# EAGLE design data_acqsation_system (EAGLE 9.6.2)
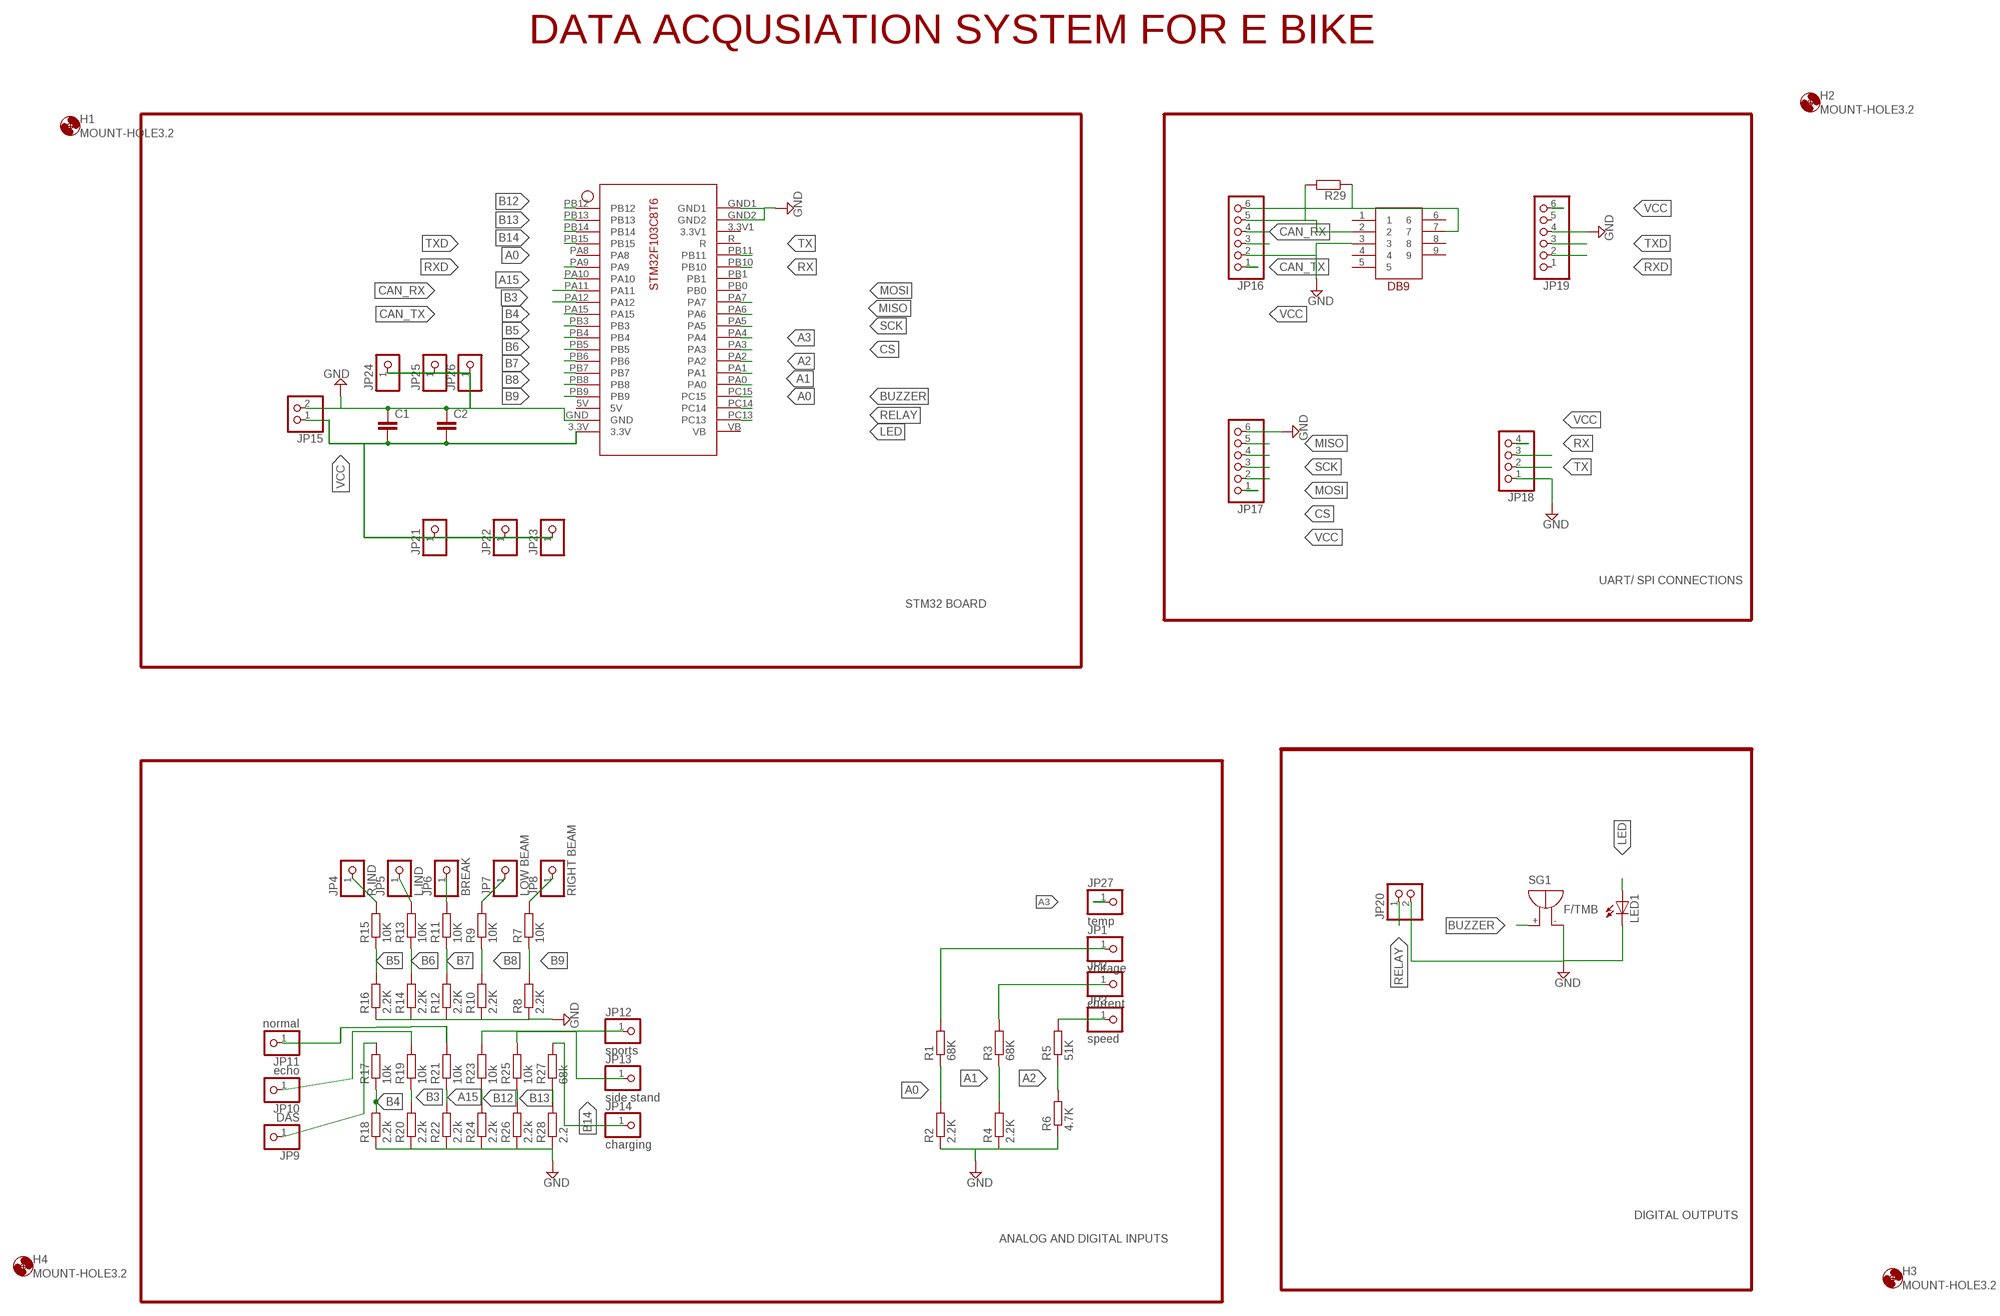
[diagram p0: schematic, sheet 1]

## Parts
C1  C2.5/6  [C2.5-6]
C2  C2.5/6  [C2.5-6]
H1  MOUNT-HOLE3.2  [3,2]
H2  MOUNT-HOLE3.2  [3,2]
H3  MOUNT-HOLE3.2  [3,2]
H4  MOUNT-HOLE3.2  [3,2]
JP1  voltage  PINHD-1X1  [1X01]
JP2  current  PINHD-1X1  [1X01]
JP3  speed  PINHD-1X1  [1X01]
JP4  R.IND  PINHD-1X1  [1X01]
JP5  L.IND  PINHD-1X1  [1X01]
JP6  BREAK  PINHD-1X1  [1X01]
JP7  LOW BEAM  PINHD-1X1  [1X01]
JP8  RIGHT BEAM  PINHD-1X1  [1X01]
JP9  DAS  PINHD-1X1  [1X01]
JP10  echo  PINHD-1X1  [1X01]
JP11  normal  PINHD-1X1  [1X01]
JP12  sports  PINHD-1X1  [1X01]
JP13  side stand  PINHD-1X1  [1X01]
JP14  charging  PINHD-1X1  [1X01]
JP15  PINHD-1X2  [1X02]
JP16  PINHD-1X6  [1X06]
JP17  PINHD-1X6  [1X06]
JP18  PINHD-1X4  [1X04]
JP19  PINHD-1X6  [1X06]
JP20  PINHD-1X2  [1X02]
JP21  PINHD-1X1  [1X01]
JP22  PINHD-1X1  [1X01]
JP23  PINHD-1X1  [1X01]
JP24  PINHD-1X1  [1X01]
JP25  PINHD-1X1  [1X01]
JP26  PINHD-1X1  [1X01]
JP27  temp  PINHD-1X1  [1X01]
LED1  LED5MM  [LED5MM]
R1  68K  R-EU_0309/12  [0309/12]
R2  2.2K  R-EU_0309/12  [0309/12]
R3  68K  R-EU_0309/12  [0309/12]
R4  2.2K  R-EU_0309/12  [0309/12]
R5  51K  R-EU_0309/12  [0309/12]
R6  4.7K  R-EU_0309/12  [0309/12]
R7  10K  R-EU_0309/12  [0309/12]
R8  2.2K  R-EU_0309/12  [0309/12]
R9  10K  R-EU_0309/12  [0309/12]
R10  2.2K  R-EU_0309/12  [0309/12]
R11  10K  R-EU_0309/12  [0309/12]
R12  2.2K  R-EU_0309/12  [0309/12]
R13  10K  R-EU_0309/12  [0309/12]
R14  2.2K  R-EU_0309/12  [0309/12]
R15  10K  R-EU_0309/12  [0309/12]
R16  2.2K  R-EU_0309/12  [0309/12]
R17  10k  R-EU_0309/12  [0309/12]
R18  2.2k  R-EU_0309/12  [0309/12]
R19  10k  R-EU_0309/12  [0309/12]
R20  2.2k  R-EU_0309/12  [0309/12]
R21  10k  R-EU_0309/12  [0309/12]
R22  2.2k  R-EU_0309/12  [0309/12]
R23  10k  R-EU_0309/12  [0309/12]
R24  2.2k  R-EU_0309/12  [0309/12]
R25  10k  R-EU_0309/12  [0309/12]
R26  2.2k  R-EU_0309/12  [0309/12]
R27  68k  R-EU_0309/12  [0309/12]
R28  2.2  R-EU_0309/12  [0309/12]
R29  R-EU_0309/12  [0309/12]
SG1  F/TMB  [F/TMB]
U$1  STM32F103C8T6  [STM32F103C8T6]
U$2  DB9  [DB9]

## Nets
A0: R1.1 R2.2 U$1.PA0 U$1.PB15
A1: R3.1 R4.2 U$1.PA1
A2: R5.1 R6.2 U$1.PA2
A3: JP27.1 U$1.PA4
A15: R21.1 R22.2 U$1.PA15
B3: R19.1 R20.2 U$1.PB3
B4: R17.1 R18.2 U$1.PB4
B5: R15.1 R16.2 U$1.PB5
B6: R13.1 R14.2 U$1.PB6
B7: R11.1 R12.2 U$1.PB7
B8: R9.1 R10.2 U$1.PB8
B9: R7.1 R8.2 U$1.PB9
B12: R23.1 R24.2 U$1.PB12
B13: R25.1 R26.2 U$1.PB13
B14: R27.1 R28.2 U$1.PB14
BUZZER: SG1.+ U$1.PC15
CAN_RX: JP16.4 U$1.PA11
CAN_TX: JP16.3 U$1.PA12
CS: JP17.2 U$1.PA3
GND: C1.1 C2.1 JP15.2 JP16.2 JP17.6 JP18.1 JP19.4 JP20.2 JP24.1 JP25.1 JP26.1 LED1.K(C) R2.1 R4.1 R6.1 R8.1 R10.1 R12.1 R14.1 R16.1 R18.1 R20.1 R22.1 R24.1 R26.1 R28.1 SG1.- U$1.GND U$1.GND1 U$1.GND2 U$2.3
LED: LED1.A U$1.PC13
MISO: JP17.5 U$1.PA6
MOSI: JP17.3 U$1.PA7
N$1: JP3.1 R5.2
N$2: JP2.1 R3.2
N$3: JP1.1 R1.2
N$4: JP11.1 R21.2
N$18: JP8.1 R7.2
N$19: JP7.1 R9.2
N$20: JP6.1 R11.2
N$21: JP5.1 R13.2
N$22: JP4.1 R15.2
N$23: JP9.1 R17.2
N$24: JP16.5 R29.2 U$2.2
N$25: JP10.1 R19.2
N$27: JP14.1 R27.2
N$28: JP13.1 R25.2
N$29: JP12.1 R23.2
N$30: JP16.6 R29.1 U$2.7
RELAY: JP20.1 U$1.PC14
RX: JP18.3 U$1.PB10
RXD: JP19.2 U$1.PA10
SCK: JP17.4 U$1.PA5
TX: JP18.2 U$1.PB11
TXD: JP19.3 U$1.PA9
VCC: C1.2 C2.2 JP15.1 JP16.1 JP17.1 JP18.4 JP19.6 JP21.1 JP22.1 JP23.1 U$1.3.3V
Unconnected: JP19.1 JP19.5 U$1.3.3V1 U$1.5V U$1.PA8 U$1.PB0 U$1.PB1 U$1.R U$1.VB U$2.1 U$2.4 U$2.5 U$2.6 U$2.8 U$2.9

## Notes on the sheet
- DATA ACQUSIATION SYSTEM FOR E BIKE
- UART/ SPI CONNECTIONS
- STM32 BOARD
- DIGITAL OUTPUTS
- ANALOG AND DIGITAL INPUTS

## Library data of the parts
C1 C2 = capacitor-wima:C: CAPACITOR naming: grid - package width
H1-H4 = holes:MOUNT-HOLE: MOUNTING HOLE with drill center marker
JP1-JP14 JP21-JP27 = pinhead:PINHD-1X1: PIN HEADER
JP15 JP20 = pinhead:PINHD-1X2: PIN HEADER
JP16 JP17 JP19 = pinhead:PINHD-1X6: PIN HEADER
JP18 = pinhead:PINHD-1X4: PIN HEADER
LED1 = led:LED: LED OSRAM: - CHIPLED LG R971, LG N971, LY N971, LG Q971, LY Q971, LO R971, LY R971 LH N974, LH R974 LS Q976, LO Q976, LY Q976 LO Q996 - Hyper CHIPLED LW Q18S LB Q993, LB Q99A, LB R99A - SideLED LS A670, LO A670, LY A670, LG A670, LP A670 LB A673, LV A673, LT A673, LW A673 LH A674 LY A675 LS A676, LA A676, LO A676, LY A676, LW A676 LS A679, LY A679, LG A679 - Hyper Micro SIDELED® LS Y876, LA Y876, LO Y876, LY Y876 LT Y87S - SmartLED LW L88C, LW L88S LB L89C, LB L89S, LG L890 LS L89K, LO L89K, LY L89K LS L896, LA L896, LO L896, LY L896 - TOPLED LS T670, LO T670, LY T670, LG T670, LP T670 LSG T670, LSP T670, LSY T670, LOP T670, LYG T670 LG T671, LOG T671, LSG T671 LB T673, LV T673, LT T673, LW T673 LH T674 LS T676, LA T676, LO T676, LY T676, LB T676, LH T676, LSB T676, LW T676 LB T67C, LV T67C, LT T67C, LS T67K, LO T67K, LY T67K, LW E67C LS E67B, LA E67B, LO E67B, LY E67B, LB E67C, LV E67C, LT E67C LW T67C LS T679, LY T679, LG T679 LS T770, LO T770, LY T770, LG T770, LP T770 LB T773, LV T773, LT T773, LW T773 LH T774 LS E675, LA E675, LY E675, LS T675 LS T776, LA T776, LO T776, LY T776, LB T776 LHGB T686 LT T68C, LB T68C - Hyper Mini TOPLED® LB M676 - Mini TOPLED Santana® LG M470 LS M47K, LO M47K, LY M47K Source: http://www.osram.convergy.de LUXEON: - LUMILED® LXK2-PW12-R00, LXK2-PW12-S00, LXK2-PW14-U00, LXK2-PW14-V00 LXK2-PM12-R00, LXK2-PM12-S00, LXK2-PM14-U00 LXK2-PE12-Q00, LXK2-PE12-R00, LXK2-PE12-S00, LXK2-PE14-T00, LXK2-PE14-U00 LXK2-PB12-K00, LXK2-PB12-L00, LXK2-PB12-M00, LXK2-PB14-N00, LXK2-PB14-P00, LXK2-PB14-Q00 LXK2-PR12-L00, LXK2-PR12-M00, LXK2-PR14-Q00, LXK2-PR14-R00 LXK2-PD12-Q00, LXK2-PD12-R00, LXK2-PD12-S00 LXK2-PH12-R00, LXK2-PH12-S00 LXK2-PL12-P00, LXK2-PL12-Q00, LXK2-PL12-R00 Source: www.luxeon.com KINGBRIGHT: KA-3528ASYC Source: www.kingbright.com
R1-R29 = rcl:R-EU_: RESISTOR, European symbol
SG1 = buzzer:F/TMB: BUZZER Source: Buerklin; OC_FARNELL: unknown; OC_NEWARK: unknown
U$1 = STM32F103C81:STM32F103C8T6
U$2 = DB9:DB9

## Board
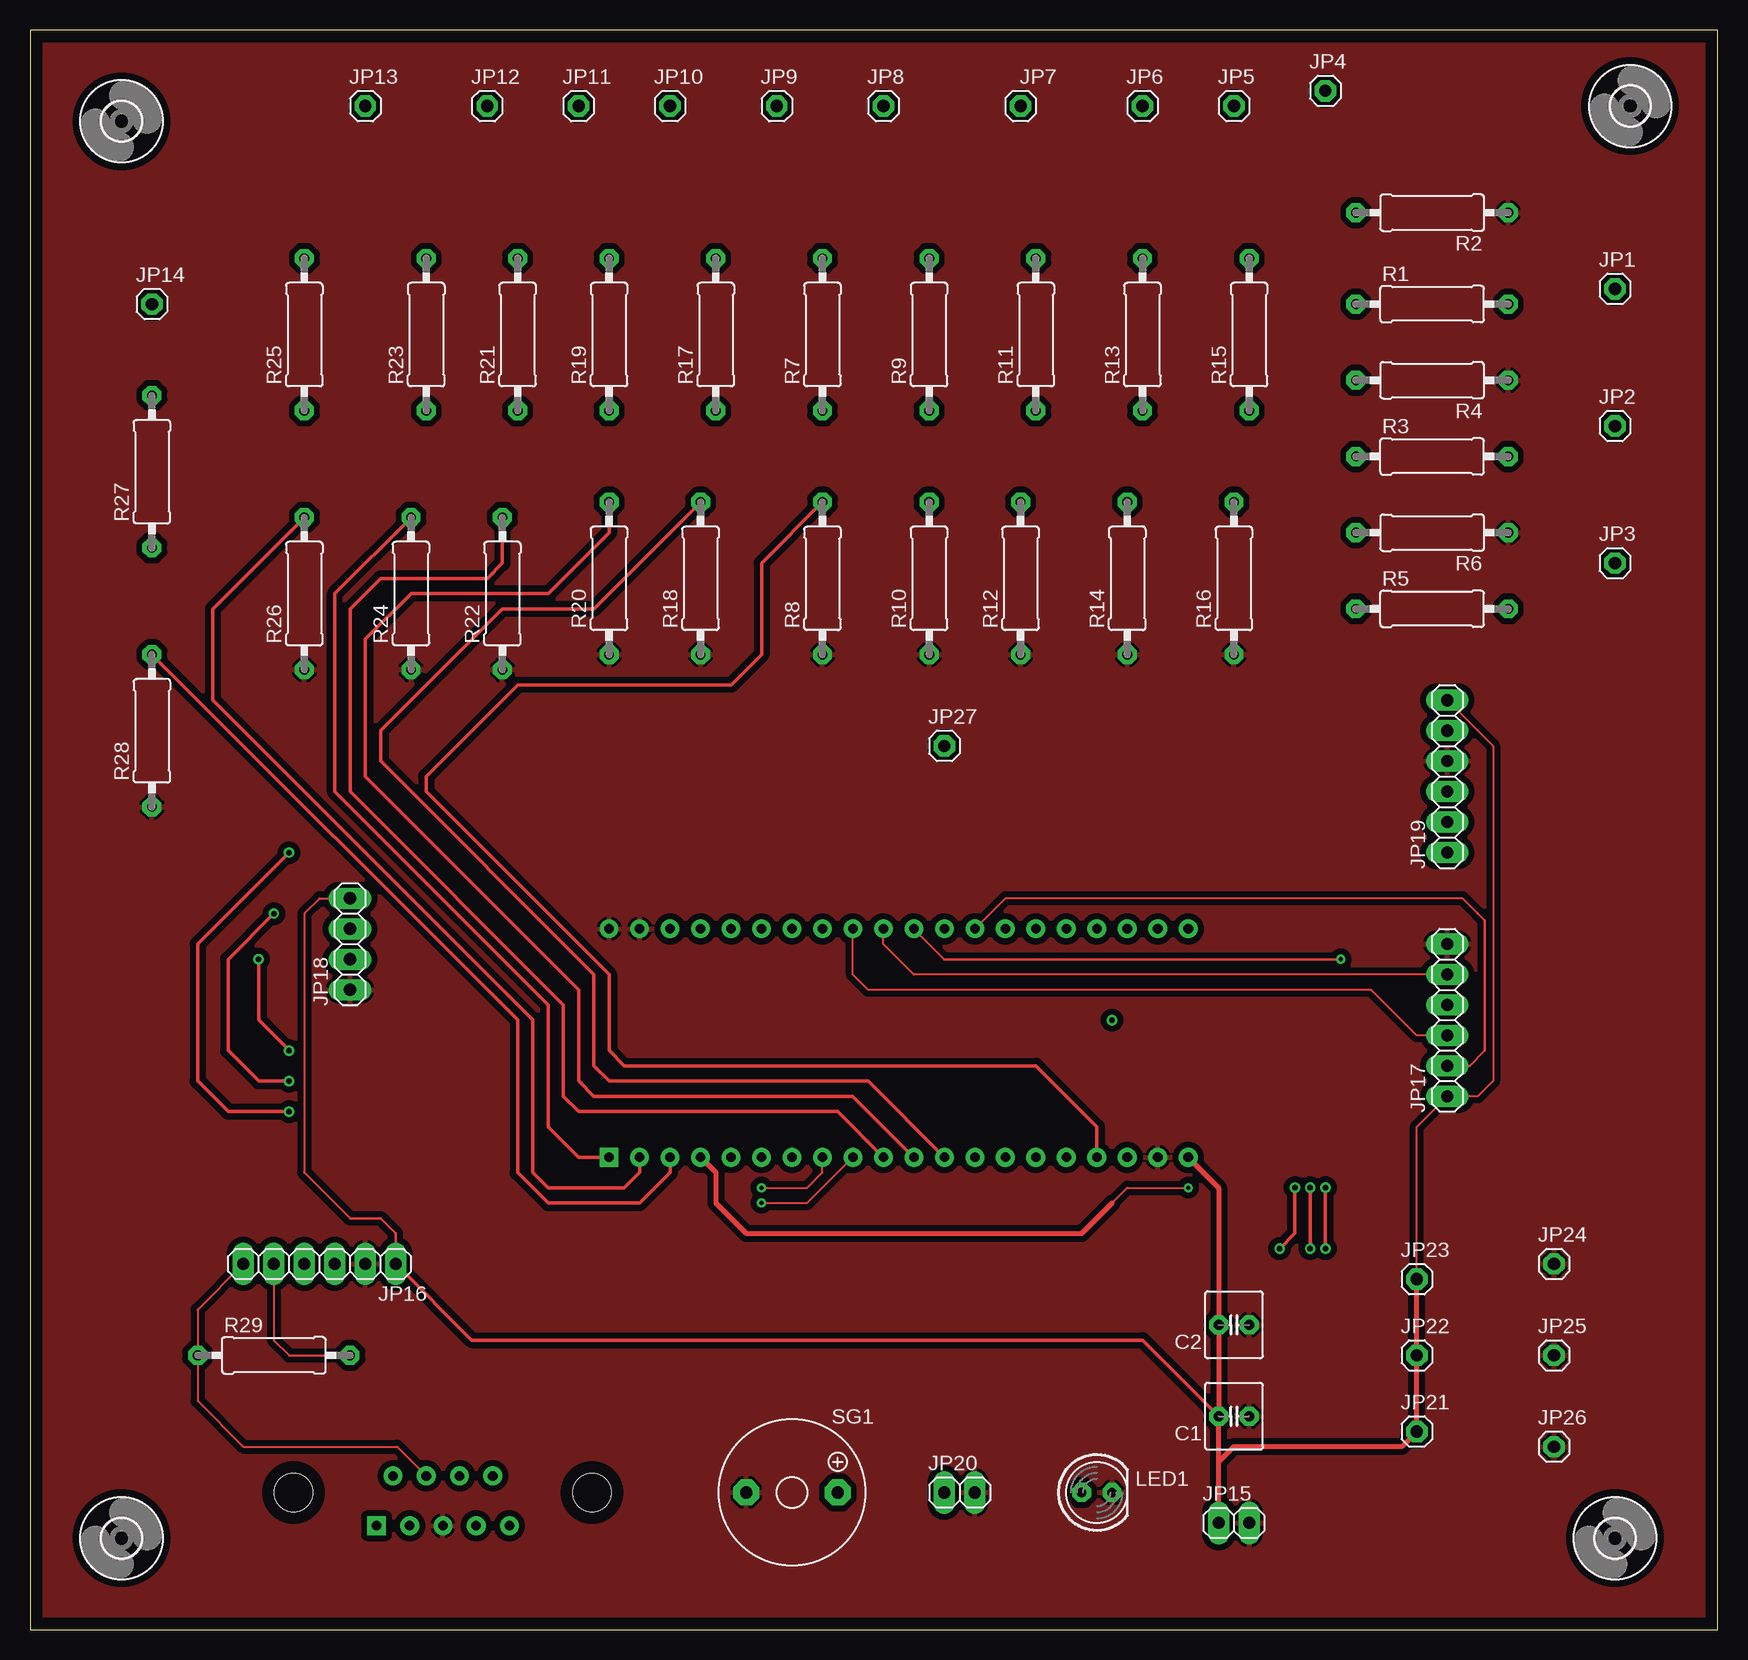
[diagram p1: board, top side]
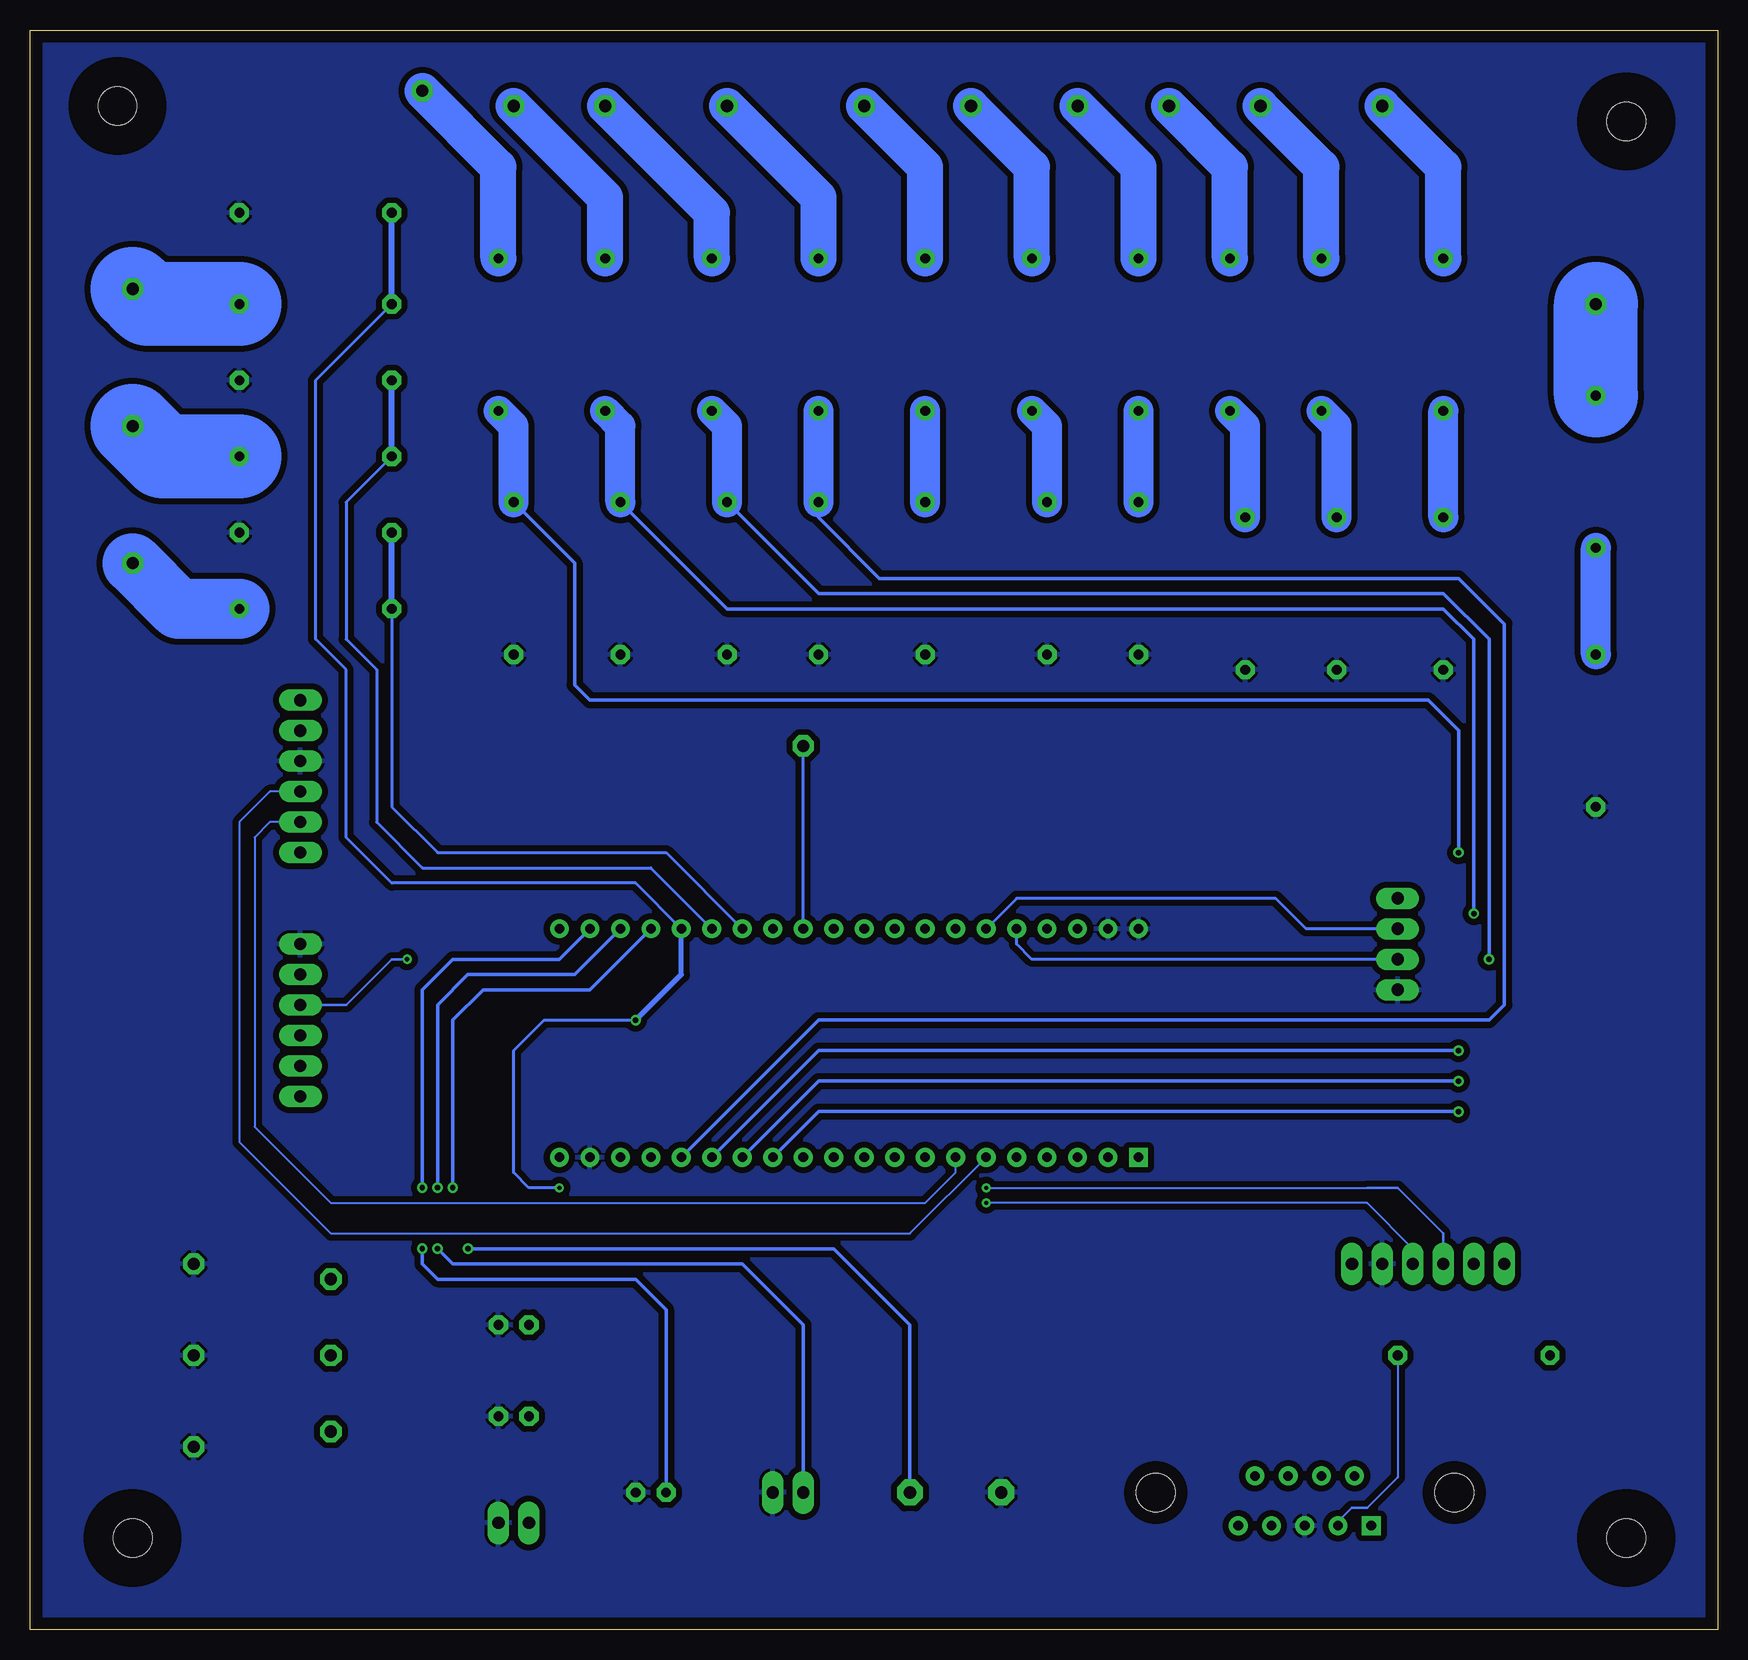
[diagram p2: board, bottom side, seen from below]

Size 140.64 x 133.34 mm. Coordinates in mm from the lower left corner, seen from the top.
Outline: 0,0 140.64,0 140.64,133.34 0,133.34 0,0
Copper layers (1*16): Top 0.035mm / dielectric 1.5mm / Bottom 0.035mm
Design rules "default *": minimum track width 6mil, minimum drill 0.35mm, track to track 20mil, track to pad 20mil, pad to pad 6mil, via to via 6mil, smd to smd 6mil, copper to edge 40mil, drill to drill 6mil, minimum pad ring 15mil, minimum via ring 8mil, stop-mask expansion 4mil, vias tented up to drill 0mil, thermal gap 10mil

### Footprints (pad centres in the part's own frame; a part is rotated, then mirrored left to right if it is on the bottom)
C2.5-6 = drill 0.813 pad 1.6 octagon: 1 -1.27,0; 2 1.27,0
3,2 = hole 3.2: 0,0
1X01 = drill 1.016 octagon: 1 0,0
1X02 = drill 1.016 long: 1 -1.27,0; 2 1.27,0
1X06 = drill 1.016 long: 1 -6.35,0; 2 -3.81,0; 3 -1.27,0; 4 1.27,0; 5 3.81,0; 6 6.35,0
1X04 = drill 1.016 long: 1 -3.81,0; 2 -1.27,0; 3 1.27,0; 4 3.81,0
LED5MM = drill 0.813 octagon: A -1.27,0; K 1.27,0
0309/12 = drill 0.813 octagon: 1 -6.35,0; 2 6.35,0
F/TMB = drill 1.016 pad 2.159 octagon: + 3.81,0; - -3.81,0
STM32F103C8T6 = drill 0.8: 3.3V -10.16,-33.02; 3.3V1 8.89,10.16; 5V -10.16,-27.94; GND -10.16,-30.48; GND1 8.89,15.24; GND2 8.89,12.7; PA0 8.89,-22.86; PA1 8.89,-20.32; PA2 8.89,-17.78; PA3 8.89,-15.24; PA4 8.89,-12.7; PA5 8.89,-10.16; PA6 8.89,-7.62; PA7 8.89,-5.08; PA8 -10.16,5.08; PA9 -10.16,2.54; PA10 -10.16,0; PA11 -10.16,-2.54; PA12 -10.16,-5.08; PA15 -10.16,-7.62; PB0 8.89,-2.54; PB1 8.89,0; PB3 -10.16,-10.16; PB4 -10.16,-12.7; PB5 -10.16,-15.24; PB6 -10.16,-17.78; PB7 -10.16,-20.32; PB8 -10.16,-22.86; PB9 -10.16,-25.4; PB10 8.89,2.54; PB11 8.89,5.08; PB13 -10.16,12.7; PB14 -10.16,10.16; PB15 -10.16,7.62; PC13 8.89,-30.48; PC14 8.89,-27.94; PC15 8.89,-25.4; R 8.89,7.62; VB 8.89,-33.02 | drill 0.8 square: PB12 -10.16,15.24
DB9 = drill 0.8 square: 1 -2.77,19.39 | drill 0.8: 2 -2.77,16.62; 3 -2.77,13.85; 4 -2.77,11.08; 5 -2.77,8.31; 6 1.385,18.005; 7 1.385,15.235; 8 1.385,12.465; 9 1.385,9.695 | hole 3.2: 0,1.43; 0,26.306

### Placement (x,y rotation side)
C1  100.33,17.78 180 top
C2  100.33,25.4 180 top
H1  7.62,7.62 0 top
H2  7.62,125.73 0 top
H3  133.35,127 0 top
H4  132.08,7.62 0 top
JP1  132.08,111.76 0 top
JP2  132.08,100.33 0 top
JP3  132.08,88.9 0 top
JP4  107.95,128.27 0 top
JP5  100.33,127 0 top
JP6  92.71,127 0 top
JP7  82.55,127 0 top
JP8  71.12,127 0 top
JP9  62.23,127 0 top
JP10  53.34,127 0 top
JP11  45.72,127 0 top
JP12  38.1,127 0 top
JP13  27.94,127 0 top
JP14  10.16,110.49 0 top
JP15  100.33,8.89 0 top
JP16  24.13,30.48 180 top
JP17  118.11,50.8 90 top
JP18  26.67,57.15 90 top
JP19  118.11,71.12 90 top
JP20  77.47,11.43 0 top
JP21  115.57,16.51 0 top
JP22  115.57,22.86 0 top
JP23  115.57,29.21 0 top
JP24  127,30.48 0 top
JP25  127,22.86 0 top
JP26  127,15.24 0 top
JP27  76.2,73.66 0 top
LED1  88.9,11.43 0 top
R1  116.84,110.49 0 top
R2  116.84,118.11 180 top
R3  116.84,97.79 0 top
R4  116.84,104.14 180 top
R5  116.84,85.09 0 top
R6  116.84,91.44 180 top
R7  66.04,107.95 90 top
R8  66.04,87.63 90 top
R9  74.93,107.95 90 top
R10  74.93,87.63 90 top
R11  83.82,107.95 90 top
R12  82.55,87.63 90 top
R13  92.71,107.95 90 top
R14  91.44,87.63 90 top
R15  101.6,107.95 90 top
R16  100.33,87.63 90 top
R17  57.15,107.95 90 top
R18  55.88,87.63 90 top
R19  48.26,107.95 90 top
R20  48.26,87.63 90 top
R21  40.64,107.95 90 top
R22  39.37,86.36 90 top
R23  33.02,107.95 90 top
R24  31.75,86.36 90 top
R25  22.86,107.95 90 top
R26  22.86,86.36 90 top
R27  10.16,96.52 90 top
R28  10.16,74.93 90 top
R29  20.32,22.86 0 top
SG1  63.5,11.43 0 top
U$1  63.5,49.53 90 top
U$2  48.26,11.43 90 top

### Tracks (layer width: path | path; a pad name or v marks a point on that pad's centre or on a via)
A0  (via drill 0.35, 0.45)
  Top 0.152: 90.17,35.56 91.44,36.83 v96.52,36.83
  Top 0.406: U$1.PB15 57.15,38.1 57.15,35.56 59.69,33.02 87.63,33.02 90.17,35.56
  Bottom 0.254: U$1.PA0 90.17,62.23 110.49,62.23 114.3,66.04 114.3,80.01 116.84,82.55 116.84,104.14 R1.1 | v96.52,36.83 99.06,36.83 100.33,38.1 100.33,48.26 97.79,50.8 v90.17,50.8
  Bottom 0.406: v90.17,50.8 86.36,54.61 U$1.PA0
  Bottom 0.508: R1.1 R2.2
A1
  Bottom 0.254: R3.1 114.3,93.98 114.3,82.55 111.76,80.01 111.76,67.31 107.95,63.5 88.9,63.5 U$1.PA1
  Bottom 0.508: R3.1 R4.2
A2
  Bottom 0.254: R5.1 110.49,68.58 106.68,64.77 87.63,64.77 U$1.PA2
  Bottom 0.508: R5.1 R6.2
A3
  Bottom 0.254: U$1.PA4 JP27.1
A15
  Top 0.305: R22.2 39.37,88.9 38.1,87.63 29.21,87.63 26.67,85.09 26.67,69.85 44.45,52.07 44.45,44.45 45.72,43.18 67.31,43.18 U$1.PA15
  Bottom 2.5: R22.2 39.37,100.33 R21.1
B3
  Top 0.305: R20.2 48.26,91.44 43.18,86.36 31.75,86.36 27.94,82.55 27.94,71.12 45.72,53.34 45.72,45.72 46.99,44.45 68.58,44.45 U$1.PB3
  Bottom 2.5: R20.2 R19.1
B4
  Top 0.305: U$1.PB4 69.85,45.72 48.26,45.72 46.99,46.99 46.99,54.61 29.21,72.39 29.21,74.93 39.37,85.09 46.99,85.09 R18.2
  Bottom 2.5: R18.2 55.88,100.33 R17.1
B5  (via drill 0.45)
  Top 0.305: v21.59,64.77 13.97,57.15 13.97,45.72 16.51,43.18 v21.59,43.18
  Bottom 0.305: U$1.PB5 74.93,43.18 v21.59,43.18 | R16.2 95.25,88.9 95.25,78.74 93.98,77.47 24.13,77.47 21.59,74.93 v21.59,64.77
  Bottom 2.5: R16.2 100.33,100.33 R15.1
B6  (via drill 0.45)
  Top 0.305: v20.32,59.69 16.51,55.88 16.51,48.26 19.05,45.72 v21.59,45.72
  Bottom 0.305: U$1.PB6 74.93,45.72 v21.59,45.72 | R14.2 82.55,85.09 22.86,85.09 20.32,82.55 v20.32,59.69
  Bottom 2.5: R14.2 91.44,100.33 R13.1
B7  (via drill 0.45)
  Top 0.305: v19.05,55.88 19.05,50.8 v21.59,48.26
  Bottom 0.305: U$1.PB7 74.93,48.26 v21.59,48.26 | R12.2 74.93,86.36 22.86,86.36 19.05,82.55 v19.05,55.88
  Bottom 2.5: R12.2 82.55,100.33 R11.1
B8
  Bottom 0.305: U$1.PB8 74.93,50.8 19.05,50.8 17.78,52.07 17.78,83.82 21.59,87.63 69.85,87.63 74.93,92.71 R10.2
  Bottom 2.5: R10.2 R9.1
B9
  Top 0.305: R8.2 60.96,88.9 60.96,81.28 58.42,78.74 40.64,78.74 33.02,71.12 33.02,69.85 48.26,54.61 48.26,48.26 49.53,46.99 83.82,46.99 88.9,41.91 U$1.PB9
  Bottom 2.5: R8.2 R7.1
B12
  Top 0.305: U$1.PB12 45.72,39.37 43.18,41.91 43.18,52.07 25.4,69.85 25.4,86.36 R24.2
  Bottom 2.5: R24.2 31.75,100.33 R23.1
B13
  Top 0.305: R26.2 15.24,85.09 15.24,77.47 41.91,50.8 41.91,38.1 43.18,36.83 49.53,36.83 50.8,38.1 U$1.PB13
  Bottom 2.5: R26.2 R25.1
B14
  Top 0.305: R28.2 40.64,50.8 40.64,38.1 43.18,35.56 50.8,35.56 53.34,38.1 U$1.PB14
  Bottom 2.5: R28.2 R27.1
BUZZER  (via drill 0.45)
  Top 0.305: v105.41,36.83 105.41,33.02 v104.14,31.75
  Bottom 0.305: U$1.PC15 93.98,53.34 102.87,53.34 105.41,50.8 v105.41,36.83 | v104.14,31.75 73.66,31.75 67.31,25.4 SG1.+
CAN_RX  (via drill 0.35)
  Top 0.152: v60.96,36.83 64.77,36.83 66.04,38.1 U$1.PA11
  Bottom 0.152: v60.96,36.83 29.21,36.83
  Bottom 0.2: 29.21,36.83 26.67,36.83 22.86,33.02 JP16.4
CAN_TX  (via drill 0.35)
  Top 0.152: v60.96,35.56 64.77,35.56 U$1.PA12
  Bottom 0.152: JP16.3 25.4,31.75 29.21,35.56 v60.96,35.56
CS
  Top 0.152: 120.65,59.69 119.38,60.96 81.28,60.96 U$1.PA3
  Top 0.2: 120.65,59.69 121.24,59.1 121.24,48.26 119.97,46.99 JP17.2
GND
  pour Top: 0,133.35 0,0 140.46,0 140.59,0.13 140.59,133.22 140.46,133.35
  pour Bottom: 140.72,0.13 140.72,133.1 140.46,133.35 0,133.35 0,0 140.46,0 140.59,0.13
LED  (via drill 0.45)
  Top 0.305: v107.95,36.83 v107.95,31.75
  Bottom 0.305: U$1.PC13 96.52,55.88 105.41,55.88 107.95,53.34 v107.95,36.83 | v107.95,31.75 107.95,30.48 106.68,29.21 90.17,29.21 87.63,26.67 LED1.A
MISO
  Top 0.152: JP17.5 73.66,54.61 71.12,57.15 U$1.PA6
MOSI
  Top 0.152: JP17.3 115.57,49.53 111.76,53.34 69.85,53.34 68.58,54.61 U$1.PA7
N$1
  Bottom 5: R5.2 128.27,85.09 JP3.1
N$2
  Bottom 7: R3.2 129.54,97.79 JP2.1
N$3
  Bottom 7: R1.2 130.81,110.49 JP1.1
N$4
  Bottom 3: R21.2 40.64,121.92 JP11.1
N$18
  Bottom 3: R7.2 66.04,121.92 JP8.1
N$19
  Bottom 3: R9.2 74.93,119.38 JP7.1
N$20
  Bottom 3: R11.2 83.82,118.11 JP6.1
N$21
  Bottom 3: R13.2 92.71,119.38 JP5.1
N$22
  Bottom 3: R15.2 101.6,121.92 JP4.1
N$23
  Bottom 3: R17.2 57.15,121.92 JP9.1
N$24
  Top 0.152: JP16.5 20.32,24.13 21.59,22.86 R29.2
  Bottom 0.152: R29.2 26.67,12.7
  Bottom 0.2: U$2.2 31.64,9 30.48,10.16 29.21,10.16 26.67,12.7
N$25
  Bottom 3: R19.2 48.26,121.92 JP10.1
N$27
  Bottom 7: R27.2 JP14.1
N$28
  Bottom 3: R25.2 22.86,121.92 JP13.1
N$29
  Bottom 3: R23.2 33.02,121.92 JP12.1
N$30
  Top 0.152: JP16.6 13.97,26.67 R29.1 13.97,19.05 17.78,15.24 30.6,15.24 U$2.7
RELAY  (via drill 0.45)
  Top 0.305: v106.68,36.83 v106.68,31.75
  Bottom 0.305: U$1.PC14 95.25,54.61 104.14,54.61 106.68,52.07 v106.68,36.83 | v106.68,31.75 105.41,30.48 81.28,30.48 76.2,25.4 JP20.1
RX
  Bottom 0.254: JP18.3 34.29,58.42 36.83,60.96 58.42,60.96 U$1.PB10
RXD
  Bottom 0.152: JP19.2 120.65,67.31 121.92,66.04 121.92,41.91 115.57,35.56 66.04,35.56 63.5,38.1 U$1.PA10
SCK  (via drill 0.35)
  Top 0.152: U$1.PA5 76.2,55.88
  Top 0.2: 76.2,55.88 v109.22,55.88
  Bottom 0.2: v109.22,55.88 110.49,55.88 114.3,52.07 JP17.4
TX
  Bottom 0.254: JP18.2 57.15,55.88 58.42,57.15 U$1.PB11
TXD
  Bottom 0.152: JP19.3 120.65,69.85 123.19,67.31 123.19,40.64 115.57,33.02 67.31,33.02 U$1.PA9
VCC
  Top 0.152: JP23.1 115.57,41.91 JP17.1 120.65,44.45 121.92,45.72 121.92,73.66 JP19.6 | 22.86,38.1 22.86,59.69 24.13,60.96 JP18.4
  Top 0.2: 22.86,38.1 26.67,34.29 29.21,34.29 30.48,33.02 JP16.1
  Top 0.305: JP16.1 36.83,24.13 92.71,24.13 C1.2
  Top 0.406: U$1.3.3V 99.06,36.83 C2.2 C1.2 99.06,13.97 | JP15.1 99.06,13.97 | 99.06,13.97 100.33,15.24 114.3,15.24 JP21.1 JP22.1 JP23.1

### Text on the board
Document: DATA ACQUSIATION SYSTEM